# EAGLE design toslink-shield (EAGLE 7.5.0)
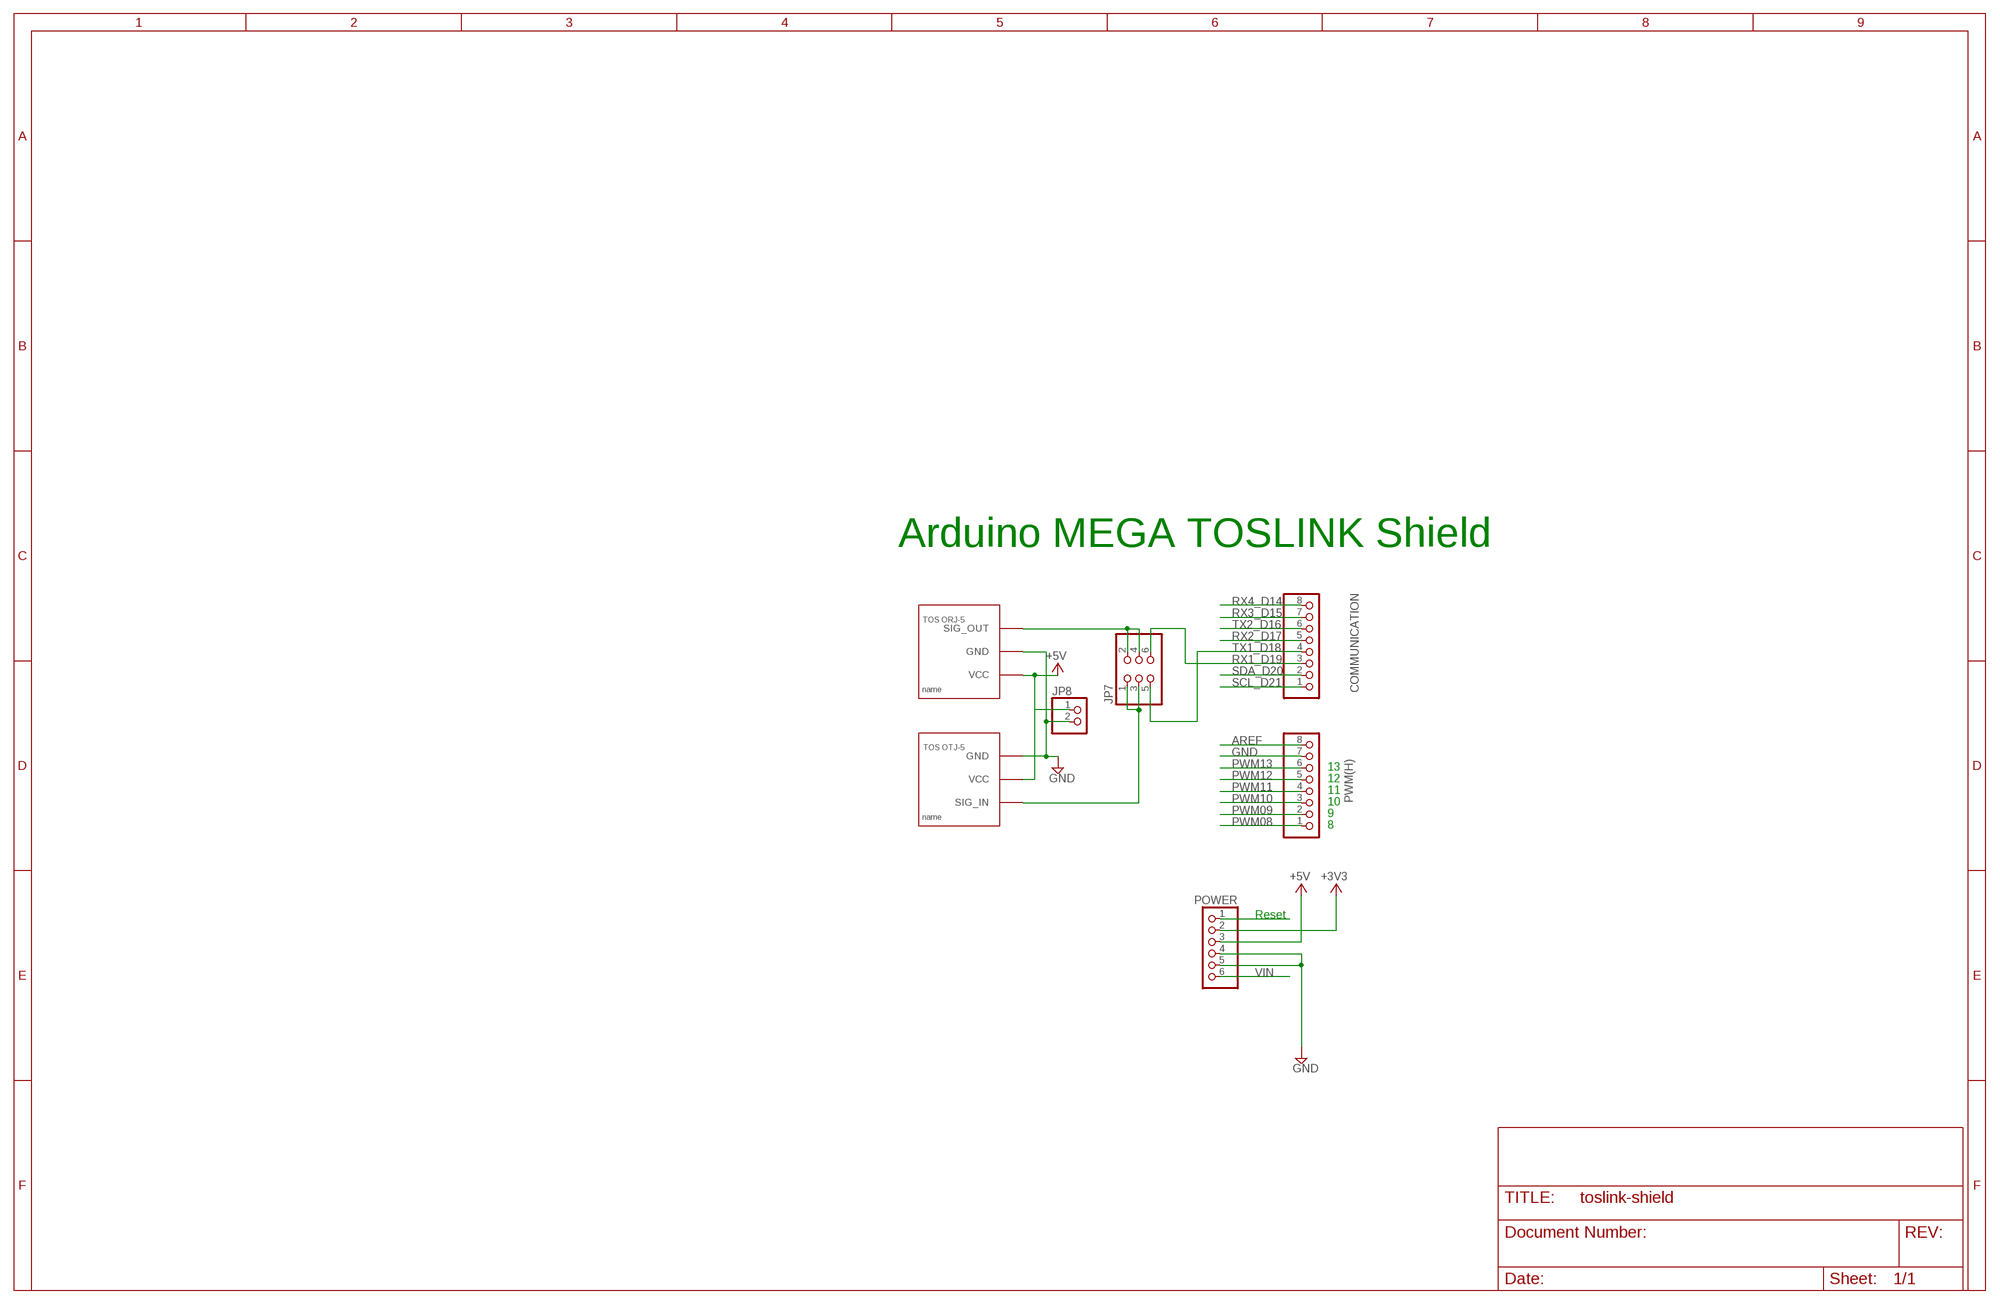
[diagram p0: schematic, sheet 1]

## Parts
COMMUNICATION  PINHD-1X8  [1X08]
JP7  PINHD-2X3  [2X03]
JP8  PINHD-1X2  [1X02]
POWER  PINHD-1X6  [1X06]
PWM(H)  PINHD-1X8  [1X08]
U$1  ORJ-5  [ORJ-5]
U$2  OTJ-5  [OTJ-5]

## Nets
+3V3 [power]: POWER.2
+5V [usbvcc]: JP8.1 POWER.3 U$1.VCC U$2.VCC
AREF: PWM(H).8
GND [gnd]: JP8.2 POWER.4 POWER.5 PWM(H).7 U$1.GND U$2.GND
N$1: JP7.2 JP7.4 U$1.SIG_OUT
N$2: JP7.1 JP7.3 U$2.SIG_IN
PWM08: PWM(H).1
PWM09: PWM(H).2
PWM10: PWM(H).3
PWM11: PWM(H).4
PWM12: PWM(H).5
PWM13: PWM(H).6
RESET: POWER.1
RX1_D19: COMMUNICATION.3 JP7.6
RX2_D17: COMMUNICATION.5
RX3_D15: COMMUNICATION.7
RX4_D14: COMMUNICATION.8
SCL_D21: COMMUNICATION.1
SDA_D20: COMMUNICATION.2
TX1_D18: COMMUNICATION.4 JP7.5
TX2_D16: COMMUNICATION.6
VIN [power]: POWER.6

## Notes on the sheet
- Arduino MEGA TOSLINK Shield
- 13
- 12
- 11
- 10
- 9
- 8
- Reset

## Library data of the parts
COMMUNICATION PWM(H) = pinhead:PINHD-1X8: PIN HEADER
JP7 = opto:PINHD-2X3: PIN HEADER
JP8 = opto:PINHD-1X2: PIN HEADER
POWER = pinhead:PINHD-1X6: PIN HEADER
U$1 = opto:ORJ-5
U$2 = opto:OTJ-5

## Net classes
0 default: width 0.203 mm, drill 0.406 mm, clearance 0.203 mm
1 power: width 0.61 mm, drill 0.711 mm, clearance 0.203 mm
2 gnd: width 0.305 mm, drill 0.711 mm, clearance 0.203 mm
3 usbvcc: width 0.508 mm, drill 0.711 mm, clearance 0.203 mm

## Board
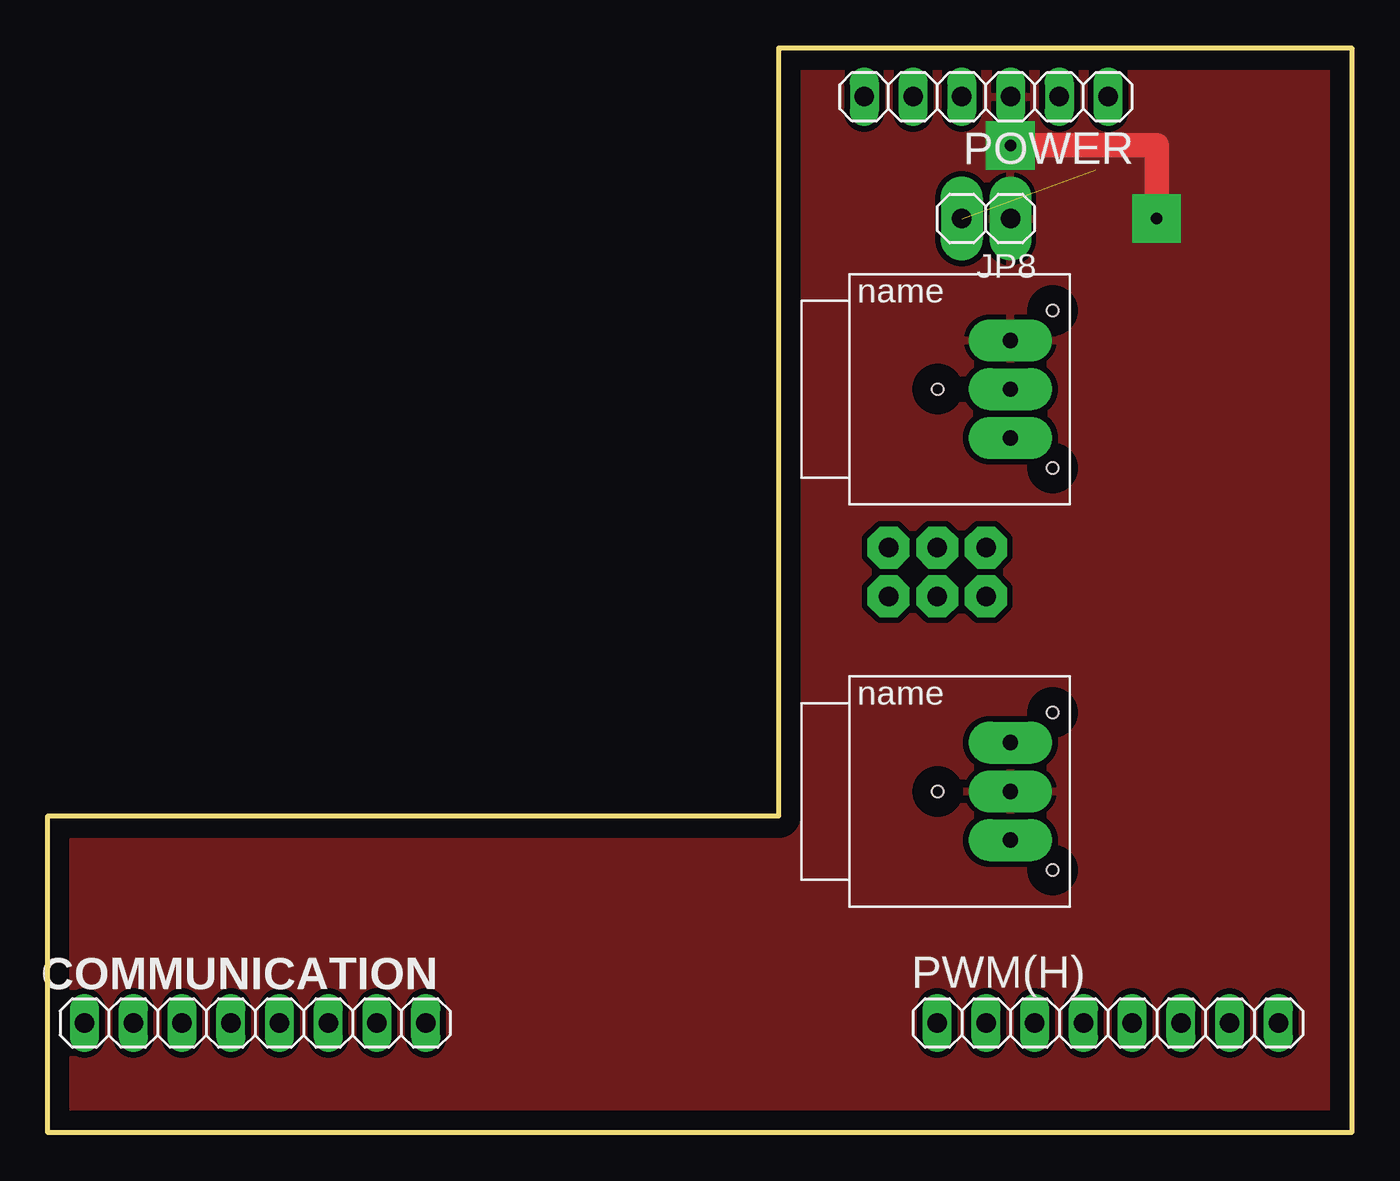
[diagram p1: board, top side]
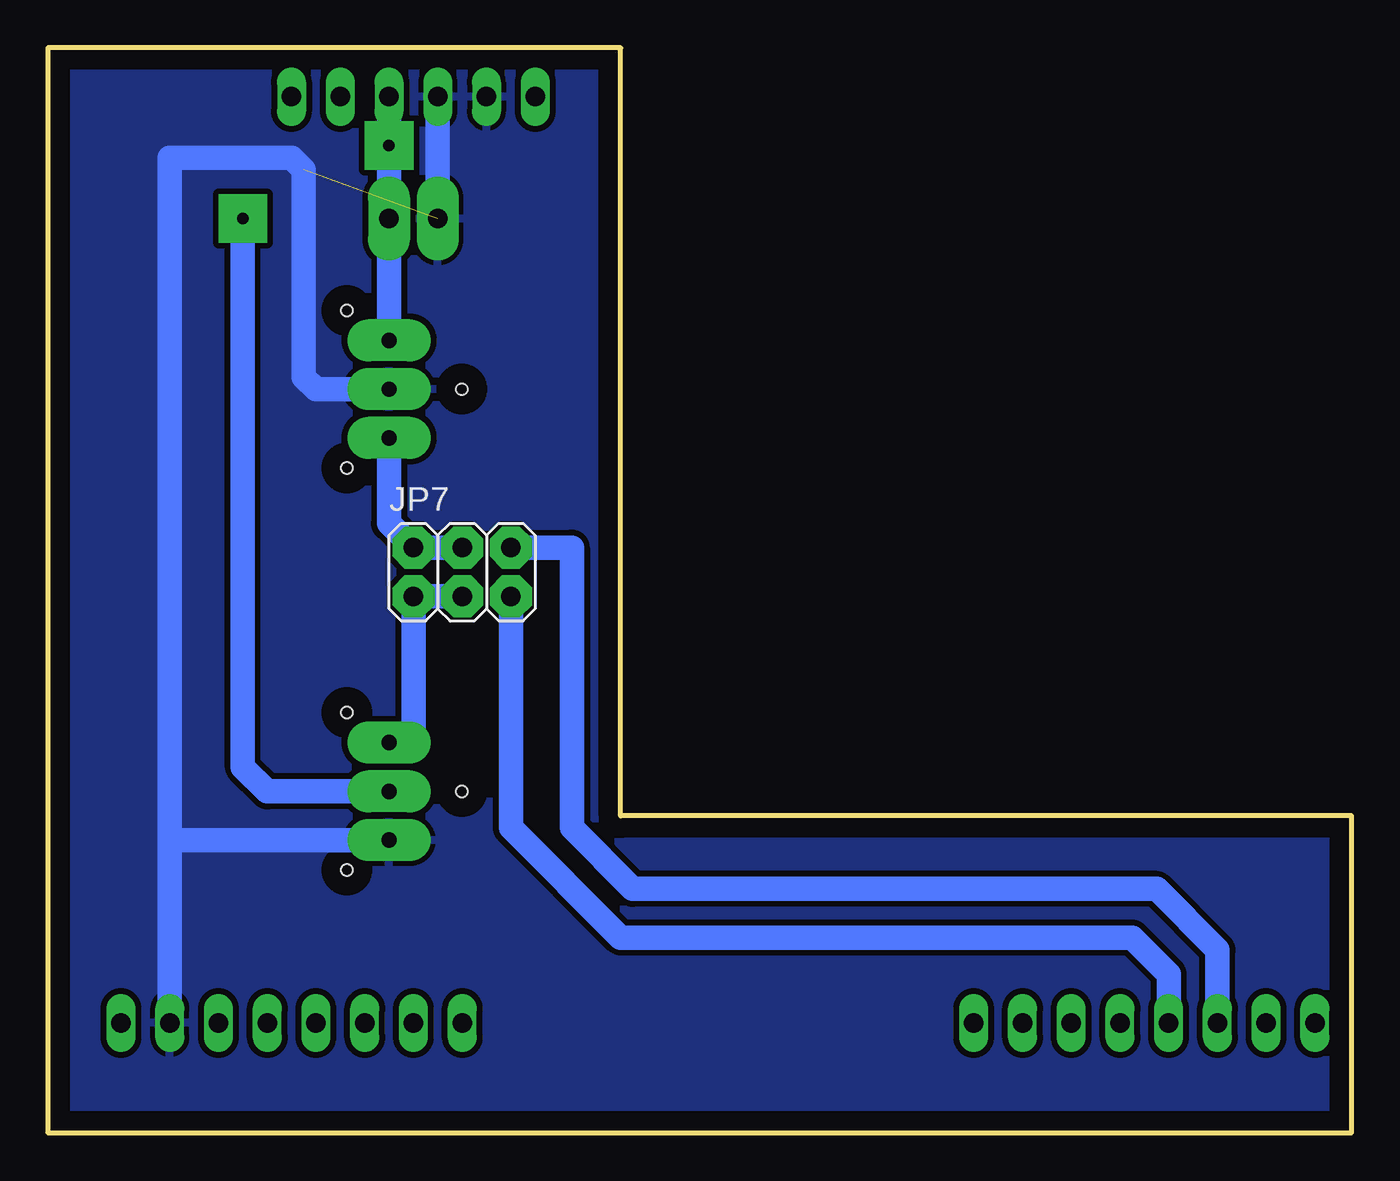
[diagram p2: board, bottom side, seen from below]

Size 67.94 x 56.52 mm. Coordinates in mm from the lower left corner, seen from the top.
Outline: 0,0 67.94,0 67.94,56.52 38.1,56.52 38.1,16.51 0,16.51 0,0
Outline: 0,1.27 0,0
Copper layers (1*16): Top 0.035mm / dielectric 1.5mm / Bottom 0.035mm
Design rules "default *": minimum track width 10mil, minimum drill 24mil, track to track 12mil, track to pad 12mil, pad to pad 12mil, via to via 12mil, smd to smd 8mil, copper to edge 40mil, drill to drill 8mil, minimum pad ring 10mil, minimum via ring 8mil, stop-mask expansion 4mil, vias tented up to drill 0mil, thermal gap 10mil

### Footprints (pad centres in the part's own frame; a part is rotated, then mirrored left to right if it is on the bottom)
1X08 = drill 1.016 long: 1 -8.89,0; 2 -6.35,0; 3 -3.81,0; 4 -1.27,0; 5 1.27,0; 6 3.81,0; 7 6.35,0; 8 8.89,0
2X03 = drill 1.016 pad 2.184 octagon: 1 -2.54,-1.27; 2 -2.54,1.27; 3 0,-1.27; 4 0,1.27; 5 2.54,-1.27; 6 2.54,1.27
1X02 = drill 1.016 pad 2.184 long: 1 -1.27,0; 2 1.27,0
1X06 = drill 1.016 long: 1 -6.35,0; 2 -3.81,0; 3 -1.27,0; 4 1.27,0; 5 3.81,0; 6 6.35,0
ORJ-5 = drill 0.8 pad 2.184 long: GND -2.54,0; SIG_OUT -2.54,-2.54; VCC -2.54,2.54 | hole 0.6: -6.34,0; -0.34,4.1; -0.34,-4.1
OTJ-5 = drill 0.8 pad 2.184 long: GND 0,-2.54; SIG_IN 0,2.54; VCC 0,0 | hole 0.6: -3.8,0; 2.2,4.1; 2.2,-4.1

### Placement (x,y rotation side)
COMMUNICATION  10.79,5.71 0 top
JP7  46.35,29.21 0 bottom
JP8  48.9,47.62 180 top
POWER  48.9,53.98 180 top
PWM(H)  55.24,5.71 0 top
U$1  52.7,38.73 0 top
U$2  50.16,17.78 0 top

### Tracks (layer width: path | path; a pad name or v marks a point on that pad's centre or on a via)
+5V  (via drill 0.6 pad 2.54)
  Top 1.27: v57.78,47.62 57.78,51.44 v50.16,51.44
  Bottom 1.27: U$1.VCC JP8.1 v50.16,51.44 POWER.3 | U$2.VCC 56.52,17.78 57.78,19.05 v57.78,47.62
  pour Top: -1.27,57.78 -1.27,-0.64 70.48,-1.27 69.85,57.78
GND  (1 unrouted)
  Bottom 1.27: POWER.4 JP8.2 | PWM(H).7 61.59,15.24 | 61.59,15.24 61.59,50.8 55.24,50.8 54.61,50.16 54.61,39.37 53.98,38.73 U$1.GND | U$2.GND 61.59,15.24
  pour Bottom: -1.27,57.78 69.85,57.78 70.48,-1.27 -1.27,-0.64
N$1
  Bottom 1.27: JP7.4 JP7.2 50.16,31.75 U$1.SIG_OUT
N$2
  Bottom 1.27: JP7.3 JP7.1 48.9,20.32 U$2.SIG_IN
RX1_D19
  Bottom 1.27: JP7.6 40.64,30.48 40.64,15.88 37.47,12.7 10.16,12.7 6.99,9.53 COMMUNICATION.3
TX1_D18
  Bottom 1.27: COMMUNICATION.4 9.53,8.26 11.43,10.16 38.1,10.16 43.81,15.88 JP7.5